# EAGLE design max30105_breakout (EAGLE 6.5.0)
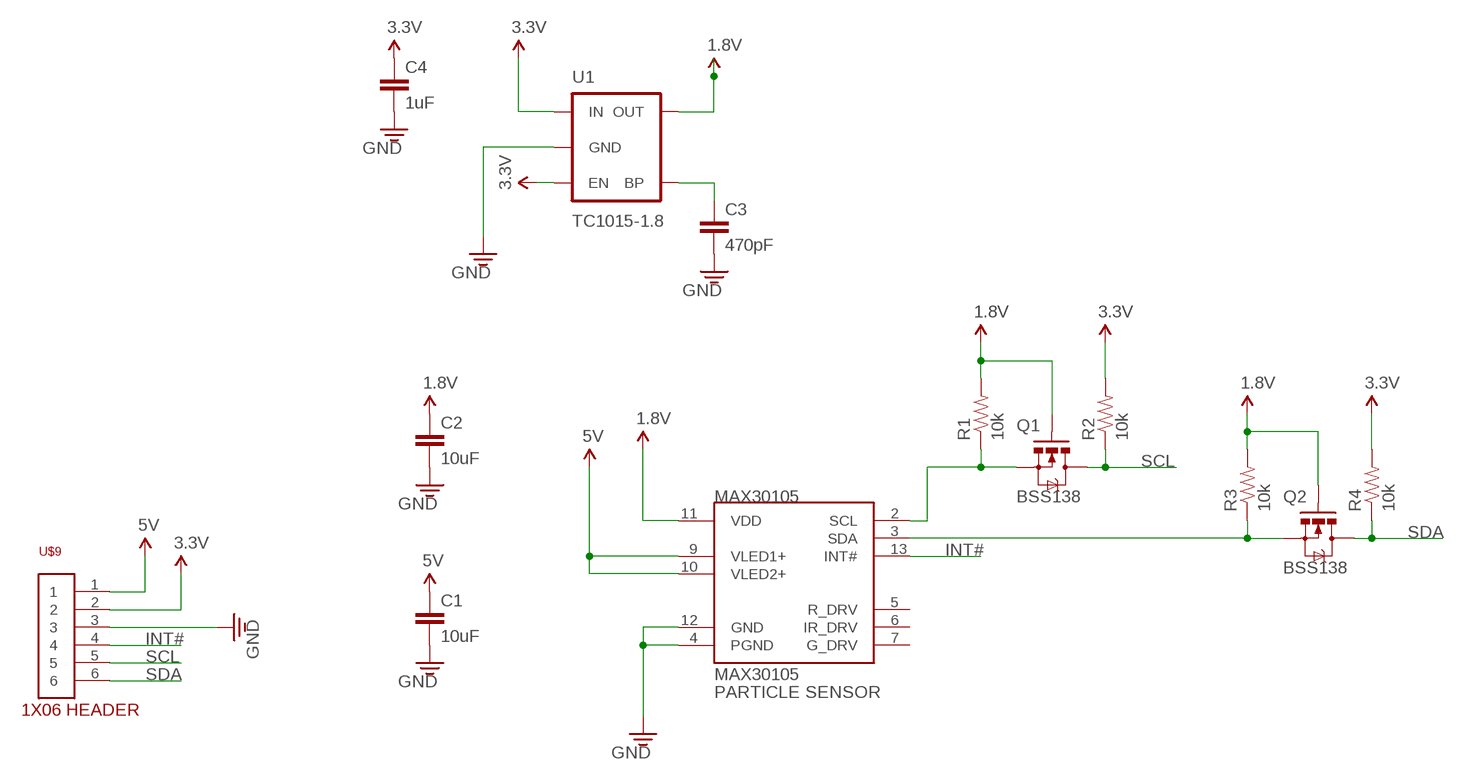
[diagram p0: schematic, sheet 1]

## Parts
C1  10uF  CAP0805  [0805]
C2  10uF  CAP0805  [0805]
C3  470pF  CAP0603  [0603]
C4  1uF  CAP0603  [0603]
MAX30105  MAX30105  [MAX30105]
Q1  BSS138  MOSFET-NCHANNELBSS138  [SOT23]
Q2  BSS138  MOSFET-NCHANNELBSS138  [SOT23]
R1  10k  RESISTOR0603  [0603]
R2  10k  RESISTOR0603  [0603]
R3  10k  RESISTOR0603  [0603]
R4  10k  RESISTOR0603  [0603]
U1  TC1015-1.8  V_REG_LDOSMD  [SOT23-5]
U$9  1X06  [1X06]

## Nets
1.8V: C2.1 MAX30105.11(VDD) Q1.1(G) Q2.1(G) R1.2 R3.2 U1.5(OUT)
3.3V: C4.1 R2.2 R4.2 U1.1(IN) U1.3(EN) U$9.2
5V: C1.1 MAX30105.9(VLED1+) MAX30105.10(VLED2+) U$9.1
GND: C1.2 C2.2 C3.2 C4.2 MAX30105.4(PGND) MAX30105.12(GND) U1.2(GND) U$9.3
INT#: MAX30105.13(INT#) U$9.4
N$3: MAX30105.2(SCL) Q1.2(S) R1.1
N$7: C3.1 U1.4(BP)
N$10: MAX30105.3(SDA) Q2.2(S) R3.1
SCL: Q1.3(D) R2.1 U$9.5
SDA: Q2.3(D) R4.1 U$9.6
Unconnected: MAX30105.5(R_DRV) MAX30105.6(IR_DRV) MAX30105.7(G_DRV)

## Library data of the parts
C1-C4 = arducorder-mini:CAP: Capacitor Standard 0603 ceramic capacitor, and 0.1" leaded capacitor.
MAX30105 = arducorder-mini:MAX30105: Maxim MAX30105 Particle Sensor withintegrated LEDs and I2C Interface
Q1 Q2 = SparkFun-DiscreteSemi:MOSFET-NCHANNEL: Common NMOSFET Parts MFG P/N Store ID Prod ID FDD8780 TRANS-09984 SI7820DN TRANS-11055 FDS6630A IC-08089 2N7002PW TRANS-11151 FQP30N06L COM-10213 TRANS-10060 BSS123LT1G TRANS-08345 BSS138 TRANS-00830 BS170 2N7000; PROD_ID: TRANS-00830
R1-R4 = arducorder-mini:RESISTOR: Resistor Basic schematic elements and footprints for 0603, 1206, and PTH 1/10th watt (small) resistors.
U1 = SparkFun-PowerIC:V_REG_LDO: Voltage Regulator LDO Standard 150mA LDO voltage regulator in SOT-23 layout. Micrel part MIC5205. BP (by-pass) pin is used to lower output noise with 470pF cap.
U$9 = arducorder-mini:1X06

## Board
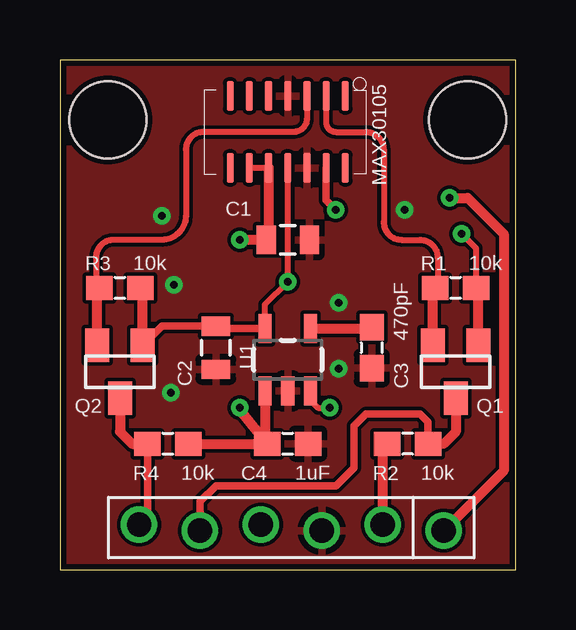
[diagram p1: board, top side]
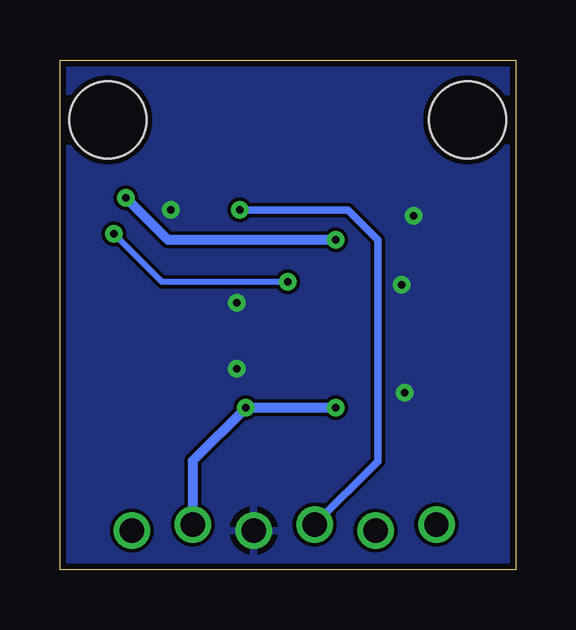
[diagram p2: board, bottom side, seen from below]

Size 19 x 21.25 mm. Coordinates in mm from the lower left corner, seen from the top.
Outline: 0,0 19,0 19,21.25 0,21.25 0,0
Copper layers (1*16): Top 0.035mm / dielectric 1.5mm / Bottom 0.035mm
Design rules "default *": minimum track width 10mil, minimum drill 13mil, track to track 6mil, track to pad 6mil, pad to pad 6mil, via to via 6mil, smd to smd 6mil, copper to edge 10mil, drill to drill 20mil, minimum pad ring 10mil, minimum via ring 8mil, stop-mask expansion 4mil, vias tented up to drill 0mil, thermal gap 10mil
Holes 3.2 mm at 2,18.75 17,18.75

### Footprints (pad centres in the part's own frame; a part is rotated, then mirrored left to right if it is on the bottom)
0805 = smd 0.8 x 1.2: 1 -0.9,0; 2 0.9,0
0603 = smd 1.1 x 1: 1 -0.85,0; 2 0.85,0
MAX30105 = smd 1.25 x 0.3: 1 -1.5,2.4; 2 -1.5,1.6; 3 -1.5,0.8; 4 -1.5,0; 5 -1.5,-0.8; 6 -1.5,-1.6; 7 -1.5,-2.4; 8 1.5,-2.4; 9 1.5,-1.6; 10 1.5,-0.8; 11 1.5,0; 12 1.5,0.8; 13 1.5,1.6; 14 1.5,2.4
SOT23 = smd 1 x 1.4: 1 -0.95,-1.1; 2 0.95,-1.1; 3 0,1.1
SOT23-5 = smd 0.55 x 1.2: 1 -0.95,-1.3; 2 0,-1.3; 3 0.95,-1.3; 4 0.95,1.3; 5 -0.95,1.3
1X06 = drill 1.016: 1 0,0.127; 2 2.54,-0.127; 3 5.08,0.127; 4 7.62,-0.127; 5 10.16,0.127; 6 12.7,-0.127

### Placement (x,y rotation side)
C1  9.5,13.75 0 top
C2  6.5,9.25 270 top
C3  13,9.25 270 top
C4  9.5,5.25 0 top
MAX30105  9.5,18.25 270 top
Q1  16.5,8.25 180 top
Q2  2.5,8.25 180 top
R1  16.5,11.75 0 top
R2  14.5,5.25 180 top
R3  2.5,11.75 0 top
R4  4.5,5.25 0 top
U1  9.5,8.75 0 top
U$9  16,1.75 180 top

### Tracks (layer width: path | path; a pad name or v marks a point on that pad's centre or on a via)
1.8V  (via drill 0.33)
  Top 0.254: U1.5 8.55,11.05 v9.5,12 MAX30105.11 | v16.75,14 17.35,13.4 R1.2
  Top 0.305: Q2.1 4.25,10.15 C2.1 6.6,10.05 U1.5
  Top 0.406: Q1.1 17.45,11.65 R1.2 | Q2.1 3.45,11.65 R3.2
  Bottom 0.254: v9.5,12 14.75,12 v16.75,14
3.3V  (via drill 0.33)
  Top 0.254: U1.3 10.5,7.4 10.5,7 10.75,6.75 v11.25,6.75
  Top 0.406: R4.2 C4.1 | U$9.2 13.46,5.06 R2.2 | C4.1 7.5,6.65 v7.5,6.75 | U1.1 8.55,5.35 C4.1
  Bottom 0.406: U$9.2 13.46,4.54 v11.25,6.75 v7.5,6.75
5V  (via drill 0.33)
  Top 0.254: MAX30105.10 MAX30105.9
  Top 0.406: MAX30105.10 8.7,13.85 C1.1 v7.5,13.75 | v16.25,15.5 17,15.5 18.5,14 18.5,4.12 U$9.1
  Bottom 0.406: v7.5,13.75 14.5,13.75 v16.25,15.5
GND  (via drill 0.33)
  other vias: 11.62,11.12 11.62,8.38 4.62,7.38 4.75,11.88 14.38,15 4.25,14.75
  pour Top: 0,0 0,21.25 19,21.25 19,0
  pour Bottom: 0,21.25 0,0 19,0 19,21.25
INT#  (via drill 0.33)
  Top 0.305: MAX30105.13 11.1,15.4 v11.5,15
  Bottom 0.305: v11.5,15 7,15 5.75,13.75 5.75,4.51 U$9.4
N$3
  Top 0.254: MAX30105.2 11.1,18.65 arc90 11.5,18.25 12.75,18.25 arc-90 13.5,17.5 13.5,14.5 arc90 14.25,13.75 15,13.75 arc-90 15.75,13 15.75,11.85 arc-90 R1.1
  Top 0.406: Q1.2 15.55,11.65 R1.1
N$7
  Top 0.406: U1.4 13,10.05 C3.1
N$10
  Top 0.254: MAX30105.3 10.3,18.8 arc-90 9.75,18.25 6,18.25 arc90 5.25,17.5 5.25,14.75 arc-90 4.25,13.75 2.25,13.75 arc90 1.5,13 1.5,11.9 arc90 R3.1
  Top 0.406: Q2.2 1.55,11.65 R3.1
SCL
  Top 0.305: R2.1 15.35,6.15 15,6.5 12.75,6.5 12.25,6 12.25,4.25 11.5,3.5 6.5,3.5 5.84,2.84 U$9.5
  Top 0.406: Q1.3 16.5,5.75 16,5.25 R2.1
SDA
  Top 0.305: U$9.6 3.65,2.23 R4.1
  Top 0.406: Q2.3 2.5,5.75 3,5.25 R4.1